# Altium schematic sheet Power.SchDoc
size A4; SheetNumber: 3; SheetTotal: 7
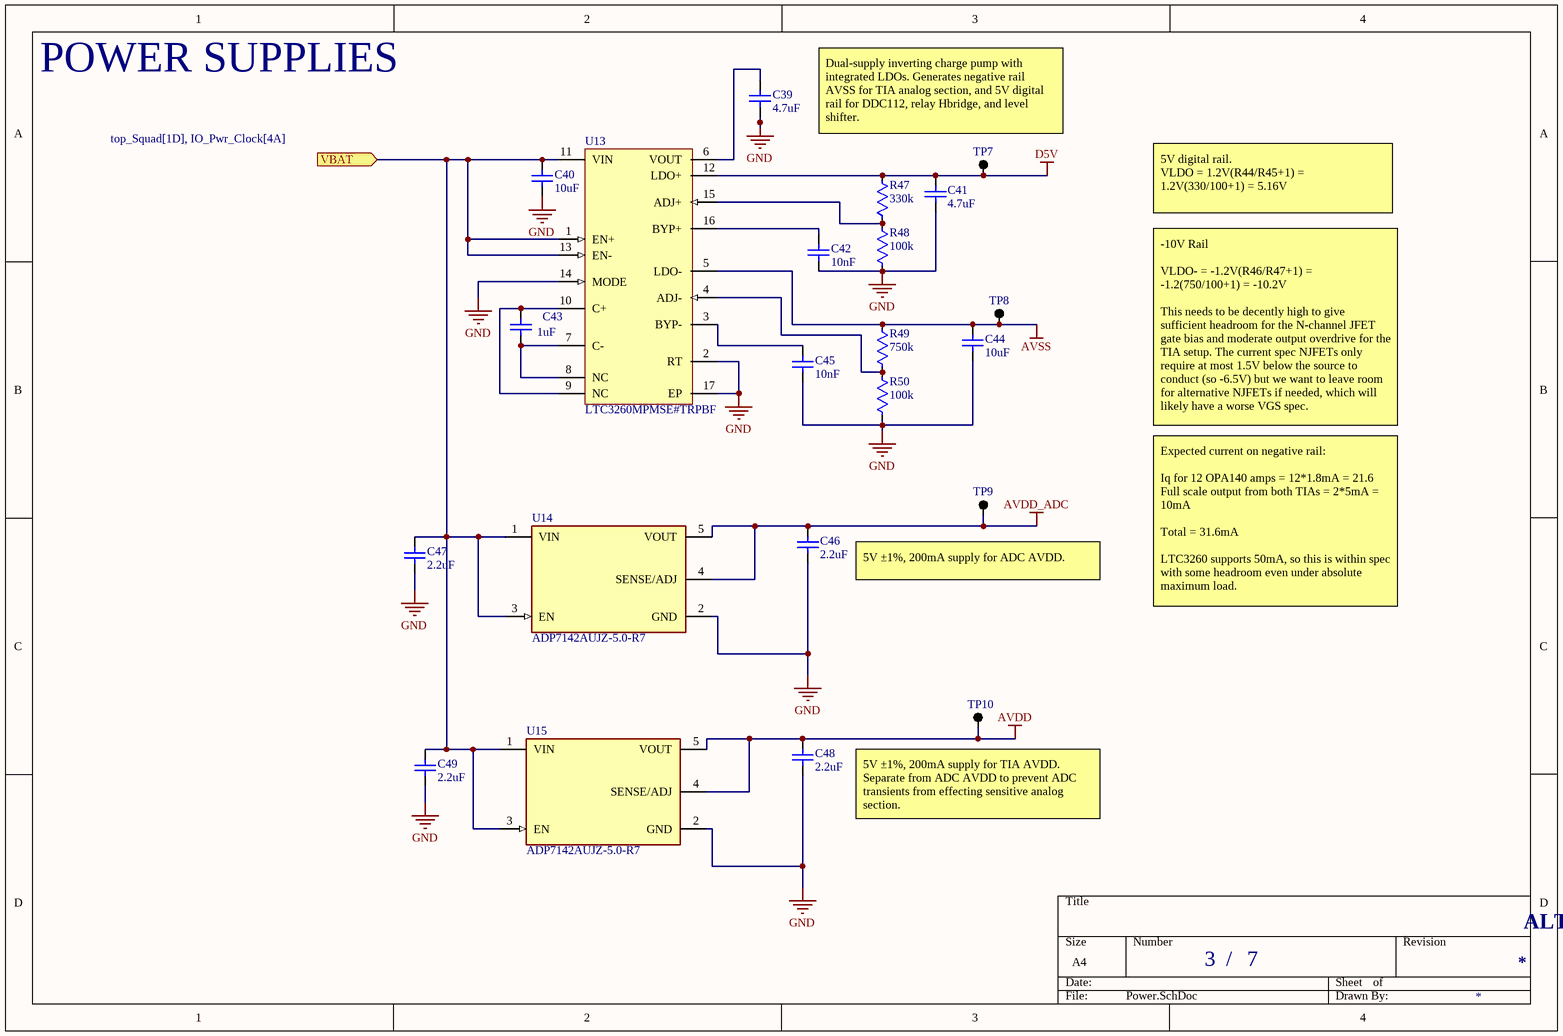
[diagram p0: Power.SchDoc]

## Parts
C39  4.7uF  [CAP 0805 IPC MID DENSITY]
C40  10uF  [CAP 0805 IPC MID DENSITY]
C41  4.7uF  [CAP 0805 IPC MID DENSITY]
C42  10nF  [CAP 0603 IPC MID DENSITY MURATA]
C43  1uF  [CAP 0805 IPC MID DENSITY]
C44  10uF  [CAP 0805 IPC MID DENSITY]
C45  10nF  [CAP 0603 IPC MID DENSITY MURATA]
C46  2.2uF  [CAP 1206 UNKNOWN]
C47  2.2uF  [CAP 1206 UNKNOWN]
C48  2.2uF  [CAP 1206 UNKNOWN]
C49  2.2uF  [CAP 1206 UNKNOWN]
R47  330k  [RES 0603 IPC MID DENSITY]
R48  100k  [RES 0603 IPC MID DENSITY]
R49  750k  [RES 0603 IPC MID DENSITY]
R50  100k  [RES 0603 IPC MID DENSITY]
TP7  Testpoint  [TESTPOINT THT]  (value not drawn)  (no BOM)
TP8  Testpoint  [TESTPOINT THT]  (value not drawn)  (no BOM)
TP9  Testpoint  [TESTPOINT THT]  (value not drawn)  (no BOM)
TP10  Testpoint  [TESTPOINT THT]  (value not drawn)  (no BOM)
U13  LTC3260MPMSE#TRPBF  [LT-MSE-16-EDP_L]
U14  ADP7142AUJZ-5.0-R7  [SOT23-5 HIGH DENSITY AD]
U15  ADP7142AUJZ-5.0-R7  [SOT23-5 HIGH DENSITY AD]

## Ports
VBAT (in, see top_Squad[1D], IO_Pwr_Clock[4A])

## Nets
AVDD: C48.1 TP10.1 U15.4(SENSE/ADJ) U15.5(VOUT)
AVDD_ADC: C46.1 TP9.1 U14.4(SENSE/ADJ) U14.5(VOUT)
AVSS: C44.2 R49.2 TP8.1 U13.5(LDO-)
D5V: C41.2 R47.2 TP7.1 U13.12(LDO+)
GND: C39.1 C40.1 C41.1 C42.1 C44.1 C45.1 C46.2 C47.2 C48.2 C49.2 R48.1 R50.1 U13.2(RT) U13.14(MODE) U13.17(EP) U14.2(GND) U15.2(GND)
VBAT: C40.2 C47.1 C49.1 U13.1(EN+) U13.11(VIN) U13.13(EN-) U14.1(VIN) U14.3(EN) U15.1(VIN) U15.3(EN) ; port VBAT
NetC39_2: C39.2 U13.6(VOUT)
NetC42_2: C42.2 U13.16(BYP+)
NetC43_1: C43.1 U13.7(C-) U13.8(NC)
NetC43_2: C43.2 U13.9(NC) U13.10(C+)
NetC45_2: C45.2 U13.3(BYP-)
NetR47_1: R47.1 R48.2 U13.15(ADJ+)
NetR49_1: R49.1 R50.2 U13.4(ADJ-)

## Notes on the sheet
- POWER SUPPLIES
- Dual-supply inverting charge pump with integrated LDOs. Generates negative rail AVSS for TIA analog section, and 5V digital rail for DDC112, relay Hbridge, and level shifter.
- 5V digital rail.
  VLDO = 1.2V(R44/R45+1) = 1.2V(330/100+1) = 5.16V
- -10V Rail
  VLDO- = -1.2V(R46/R47+1) = -1.2(750/100+1) = -10.2V
  This needs to be decently high to give sufficient headroom for the N-channel JFET gate bias and moderate output overdrive for the TIA setup. The current spec NJFETs only require at most 1.5V below the source to conduct (so -6.5V) but we want to leave room for alternative NJFETs if needed, which will likely have a worse VGS spec.
- 5V ±1%, 200mA supply for ADC AVDD.
- Expected current on negative rail:
  Iq for 12 OPA140 amps = 12*1.8mA = 21.6
  Full scale output from both TIAs = 2*5mA = 10mA
  Total = 31.6mA
  LTC3260 supports 50mA, so this is within spec with some headroom even under absolute maximum load.
- (near TP10) 5V ±1%, 200mA supply for TIA AVDD. Separate from ADC AVDD to prevent ADC transients from effecting sensitive analog section.
- /
- ALTAIR PhotoDiode ReadOut (PDRO) - Squad

## Library data of the parts
C39-C45 = CAP: Murata GRM21BR61E106KA73L - Cap Ceramic 10uF 10% 25V X5R 0805; MF: Murata; MP: GRM21BR61E106KA73L
C46-C49 = CAP: CL31B225KBHNNNE CAP CER 2.2UF 50V X7R 1206; MF: Samsung Electro-Mechanics; MP: CL31B225KBHNNNE
R47 R49 = RES: Panasonic ERJ-3EKF2001V Res Thick Film 0603 2K Ohm 1% 1/10W ±100ppm/°C; MF: Panasonic Electronic Components; MP: ERJ-3EKF2001V
R48 R50 = RES: -55℃~+155℃ 100kΩ 100mW 75V Thick Film Resistor ±1% ±100ppm/℃ 0603 Chip Resistor - Surface Mount ROHS; MF: UNI-ROYAL(Uniroyal Elec); MP: 0603WAF1003T5E
U13 = CMP-0475-00262-1: Low Noise Dual Supply Inverting Charge Pump, 4.5 to 32 V Vin, Adjustable Vout, 16-pin SOP (MSE-16-EDP), -50 to 150 degC, Pb-Free, Tape and Reel; Manufacturer: Linear Technology; Voutput: Adj; Isupply(mA): 0.1; Vin Max(V): 32; Frequency(kHz): 500; Max Iout(mA): 100; Ishutdown(uA): 2; Vin Min(V): 4.5; RoHS: TRUE; ComponentLink1URL: http://www.linear.com/; Packing: Tape and Reel; ComponentLink3Description: Package Specification; ComponentLink3URL: http://cds.linear.com/docs/en/packaging/05081667_F_MSE16.pdf; Mounting Technology: Surface Mount; PackageReference: MSE-16; PackageDescription: 16-Pin Plastic MSOP, Exposed Die Pad, Body 4.039 x 3 mm, Pitch 0.5 mm; ComponentLink1Description: Manufacturer URL; ComponentLink2URL: http://cds.linear.com/docs/en/datasheet/3260fa.pdf; PartNumber: LTC3260MPMSE#TRPBF; PackageVersion: Rev. F, 05/2013; ComponentLink2Description: Datasheet; DatasheetVersion: Rev. A
U14 U15 = ADP7142AUJZ-R7: 1.2-40V 200mA Low Noise CMOS LDO Adjustable Linear Regulator TSOT23; Nominal Supply Current: 50-180uA; Output Type: AdjustableProgrammable; Max Supply Voltage: 40V; Number Of Outputs: 1; Dropout Voltage: 200mV; Output Voltage: 1.2-5V; Min Supply Voltage: 2.7V; Max Junction Temp: +150°C; MF: Analog Devices; Accuracy Percentage: 0.8%; Ambient Temperature Range Low: -40°C; ComponentLink2Description: Datasheet; Digikey Description: IC REG LIN POS ADJ 200MA TSOT23; Device Class L1: Integrated Circuits (ICs); Mouser Description: LDO Regulator Pos 1.5V to 5V 0.2A 5-Pin TSOT-23 T/R; Height: 1mm; Temperature Range Low: -40°C; Output Current: 200mA; Device Class L3: Voltage Regulators - Linear; Octopart: https://octopart.com/adp7142aujz-r7-analog+devices-38928114; Category: IC; MP: ADP7142AUJZ-5.0-R7; ComponentLink2URL: https://www.analog.com/media/en/technical-documentation/data-sheets/ADP7142.pdf; Device Class L2: Power Management ICs; Package: UJ-5; Automotive: No; Lead Free: Yes; Ambient Temperature Range High: +125°C; Temperature: -40°C to +125°C; Temperature Range High: +125°C; RoHS: TRUE; Manufacturer: Analog Devices; Manufacturer Part Number: ADP7142AUJZ-R7